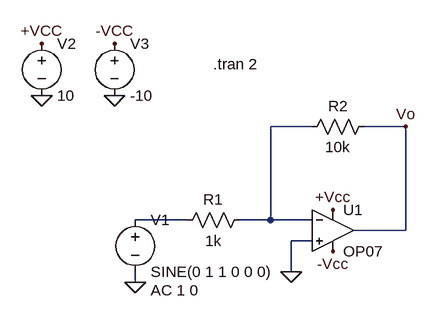
[diagram p0: schematic Draft2.asc]
Draft2.asc, the LTspice schematic file:
Version 4
SHEET 1 880 680
WIRE 192 -32 128 -32
WIRE 336 -32 272 -32
WIRE 0 112 -80 112
WIRE 128 112 128 -32
WIRE 128 112 80 112
WIRE 192 112 128 112
WIRE 336 128 336 -32
WIRE 336 128 256 128
WIRE 192 144 160 144
WIRE 160 192 160 144
WIRE -80 208 -80 192
FLAG 160 192 0
FLAG -80 208 0
FLAG 336 -32 Vo
FLAG -224 -80 0
FLAG -112 -80 0
FLAG -224 -160 +VCC
FLAG -112 -160 -VCC
FLAG 224 96 +Vcc
FLAG 224 160 -Vcc
SYMBOL res 96 96 R90
WINDOW 0 0 56 VBottom 2
WINDOW 3 32 56 VTop 2
SYMATTR InstName R1
SYMATTR Value 1k
SYMBOL voltage -80 96 R0
WINDOW 123 24 124 Left 2
WINDOW 39 0 0 Left 0
SYMATTR InstName V1
SYMATTR Value SINE(0 1 1 0 0 0)
SYMATTR Value2 AC 1 0
SYMBOL Opamps\\OP07 224 64 R0
SYMATTR InstName U1
SYMBOL voltage -224 -176 R0
WINDOW 123 0 0 Left 0
WINDOW 39 0 0 Left 0
SYMATTR InstName V2
SYMATTR Value 10
SYMBOL voltage -112 -176 R0
WINDOW 123 0 0 Left 0
WINDOW 39 0 0 Left 0
SYMATTR InstName V3
SYMATTR Value -10
SYMBOL res 288 -48 R90
WINDOW 0 0 56 VBottom 2
WINDOW 3 32 56 VTop 2
SYMATTR InstName R2
SYMATTR Value 10k
TEXT 40 -128 Left 2 !.tran 2

The netlist it stands for:
* Draft2.asc
R1 N001 N002 1k
V1 N002 0 SINE(0 1 1 0 0 0) AC 1 0
XU1 0 N001 +VCC -VCC Vo LT1001  ; OP07, pins In+ In- V+ V- OUT
V2 +VCC 0 10
V3 -VCC 0 -10
R2 Vo N001 10k
.tran 2
.lib LTC.lib
.backanno
.end